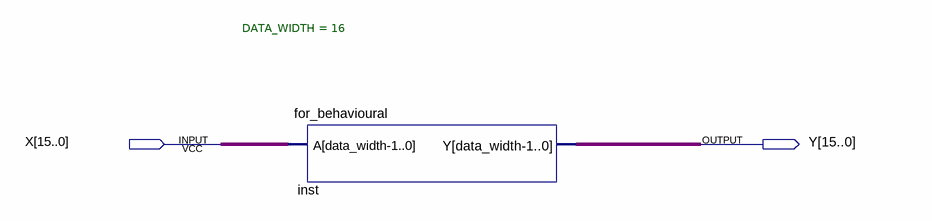
[diagram p0: schematic sheet]
// Quartus schematic behavioural.bdf as structural Verilog: 1 symbols, 2 pins
module behavioural (
  input  [15:0] X,
  output [15:0] Y
);

  for_behavioural #(.DATA_WIDTH(16)) inst (.A(X), .Y(Y));
endmodule
